# Altium project RTL_SDR_RPi_NanoPiAir_shield_V_1.PrjPcb
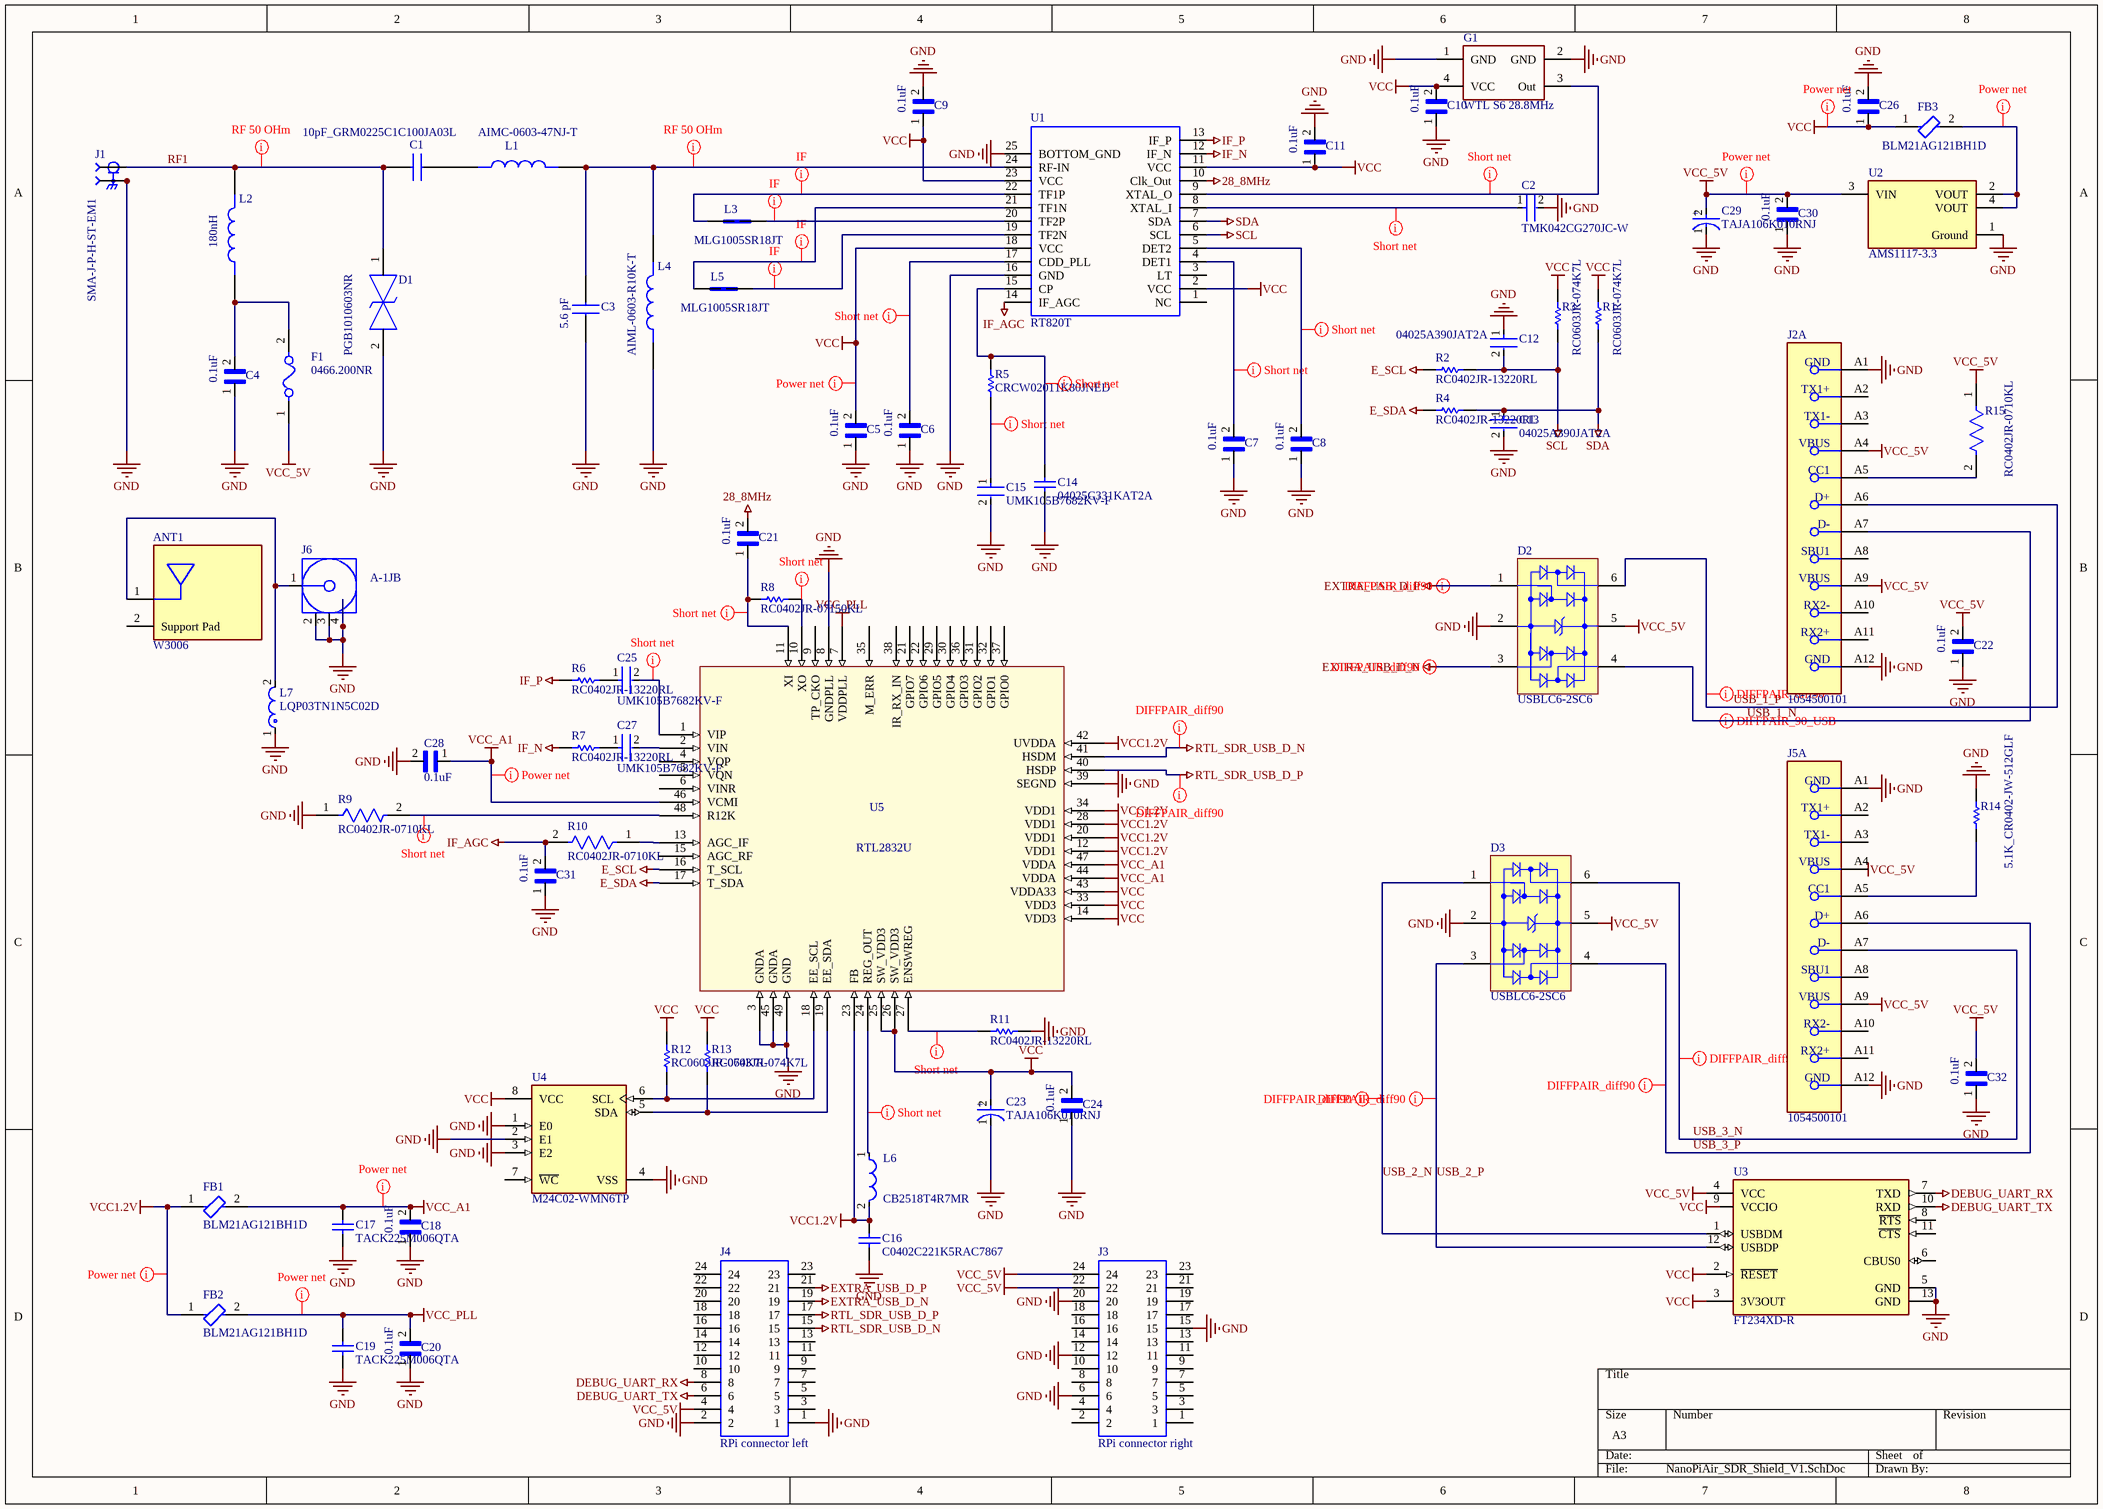
[diagram p0: NanoPiAir_SDR_Shield_V1.SchDoc]
1 sheet, 74 parts. Net scope: global (net labels, ports and power ports of the same name join across sheets).
Board file: NanoPiAir_Shield_V1.PcbDoc

## Sheet NanoPiAir_SDR_Shield_V1.SchDoc
size A3; SheetNumber: 1; SheetTotal: 1; SPICEModelCacheYCATXEQH: <root> / <DocumentId>YCATXEQH</DocumentId> / </root>

### Parts
ANT1  W3006  [FP-W3006-0]
C1  10pF_GRM0225C1C100JA03L  [CAPC0402X22N]
C2  TMK042CG270JC-W  [FP-01005-L_0_4_0_02-W_0_2-MFG]
C3  5.6 pF  [C0603]
C4  0.1uF  [CAPC1005X55N]
C5  0.1uF  [CAPC1005X55N]
C6  0.1uF  [CAPC1005X55N]
C7  0.1uF  [CAPC1005X55N]
C8  0.1uF  [CAPC1005X55N]
C9  0.1uF  [CAPC1005X55N]
C10  0.1uF  [CAPC1005X55N]
C11  0.1uF  [CAPC1005X55N]
C12  04025A390JAT2A  [FP-0402-L_1_0_1-W_0_5_0_1-IPC_B]
C13  04025A390JAT2A  [FP-0402-L_1_0_1-W_0_5_0_1-IPC_B]
C14  04025C331KAT2A  [CAPC1005X56X25NL10T15]
C15  UMK105B7682KV-F  [FP-0402-L_1_0_0_05-W_0_5-IPC_C]
C16  C0402C221K5RAC7867  [CAPC1005X60X30NL05T10]
C17  TACK225M006QTA  [CAPC1005X70X10NL20T00]
C18  0.1uF  [CAPC1005X55N]
C19  TACK225M006QTA  [CAPC1005X70X10NL20T00]
C20  0.1uF  [CAPC1005X55N]
C21  0.1uF  [CAPC1005X55N]
C22  0.1uF  [CAPC1005X55N]
C23  TAJA106K010RNJ  [FP-TAJA-MFG]
C24  0.1uF  [CAPC1005X55N]
C25  UMK105B7682KV-F  [FP-0402-L_1_0_0_05-W_0_5-IPC_C]
C26  0.1uF  [CAPC1005X55N]
C27  UMK105B7682KV-F  [FP-0402-L_1_0_0_05-W_0_5-IPC_C]
C28  0.1uF  [CAPC1005X55N]
C29  TAJA106K010RNJ  [FP-TAJA-MFG]
C30  0.1uF  [CAPC1005X55N]
C31  0.1uF  [CAPC1005X55N]
C32  0.1uF  [CAPC1005X55N]
D1  PGB1010603NR  [PGB1010603MR]
D2  USBLC6-2SC6  [STM-SOT23-6L_V]
D3  USBLC6-2SC6  [STM-SOT23-6L_V]
F1  0466.200NR  [FP-0466-MFG]
FB1  BLM21AG121BH1D  [FP-BLM21-0_2-t0_85-e0_5-IPC_B]
FB2  BLM21AG121BH1D  [FP-BLM21-0_2-t0_85-e0_5-IPC_B]
FB3  BLM21AG121BH1D  [FP-BLM21-0_2-t0_85-e0_5-IPC_B]
G1  WTL S6 28.8MHz  [XTAL_RTL_SDR(CHINA_WTL_S6)]
J1  SMA-J-P-H-ST-EM1  [SAMTEC_SMA-J-P-H-ST-EM1]
J2  1054500101  [FP-1054500101-MFG]  (part A of 3)
J3  RPi connector right  [RHDR24W77P254X254_2X12_3048X503X673P]
J4  RPi connector left  [RHDR24W77P254X254_2X12_3048X503X673P]
J5  1054500101  [FP-1054500101-MFG]  (part A of 3)
J6  A-1JB  [AMPH-A-1JB_V]
L1  AIMC-0603-47NJ-T  [INDC1608X95N]
L2  180nH  [INDC1608X95N]
L3  MLG1005SR18JT  [CAPC1005X55N]
L4  AIML-0603-R10K-T  [INDC1608X95N]
L5  MLG1005SR18JT  [CAPC1005X55N]
L6  CB2518T4R7MR  [FP-CB2518-IPC_B]
L7  LQP03TN1N5C02D  [FP-LQP03TG_02-IPC_A]
R1  RC0603JR-074K7L  [RESC1608X55X25ML10T15]
R2  RC0402JR-13220RL  [RESC1005X40X25ML05T10]
R3  RC0603JR-074K7L  [RESC1608X55X25ML10T15]
R4  RC0402JR-13220RL  [RESC1005X40X25ML05T10]
R5  CRCW02011K80JNED  [RESC0603X28X15LL05T05]
R6  RC0402JR-13220RL  [RESC1005X40X25ML05T10]
R7  RC0402JR-13220RL  [RESC1005X40X25ML05T10]
R8  RC0402JR-07150KL  [RESC1005X40X25ML05T10]
R9  RC0402JR-0710KL  [FP-RC0402-0_4-IPC_C]
R10  RC0402JR-0710KL  [FP-RC0402-0_4-IPC_C]
R11  RC0402JR-13220RL  [RESC1005X40X25ML05T10]
R12  RC0603JR-074K7L  [RESC1608X55X25ML10T15]
R13  RC0603JR-074K7L  [RESC1608X55X25ML10T15]
R14  5.1K_CR0402-JW-512GLF  [RESC1005X40X25LL10T10]
R15  RC0402JR-0710KL  [FP-RC0402-0_4-IPC_C]
U1  RT820T  [EFM8LB12F64ES0BQFN24]
U2  AMS1117-3.3  [FP-AMS1117-IPC_C]
U3  FT234XD-R  [FP-DFN-12-IPC_B]
U4  M24C02-WMN6TP  [FP-SO8N-SO-A-MFG]
U5  RTL2832U  [QFN40P600X600X84_HS-49N]

### Nets
28_8MHz: C21.2 U1.10(Clk_Out)
DEBUG_UART_RX: J4.8 U3.7(TXD)
DEBUG_UART_TX: J4.6 U3.10(RXD)
E_SCL: R2.1 U5.16(T_SCL)
E_SDA: R4.1 U5.17(T_SDA)
EXTRA_USB_D_N: D2.3(I/O_2) J4.19
EXTRA_USB_D_P: D2.1(I/O_1) J4.21
GND: C2.2 C3.1 C4.1 C5.1 C6.1 C7.1 C8.1 C9.2 C10.1 C11.2 C12.1 C13.2 C14.1 C15.2 C16.1 C17.1 C18.1 C19.1 C20.1 C22.1 C23.1(C) C24.1 C26.2 C28.2 C29.1(C) C30.1 C31.1 C32.1 D1.2 D2.2(GND) D3.2(GND) G1.1(GND) G1.2(GND) J1.2_1 J1.2_2 J1.3_1 J1.3_2 J2.A1(GND) J2.A12(GND) J3.6 J3.12 J3.15 J3.20 J4.1 J4.2 J5.A1(GND) J5.A12(GND) J6.2 J6.3 J6.4 L4.1 L7.1 R9.1 R11.2 R14.2 U1.16(GND) U1.25(BOTTOM_GND) U2.1(Ground) U3.5(GND) U3.13(GND) U4.1(E0) U4.2(E1) U4.3(E2) U4.4(VSS) U5.3(GNDA) U5.8(GNDPLL) U5.39(SEGND) U5.45(GNDA) U5.49(GND)
IF_AGC: C31.2 R10.2 U1.14(IF_AGC)
IF_N: R7.1 U1.12(IF_N)
IF_P: R6.1 U1.13(IF_P)
RTL_SDR_USB_D_N: J4.15 U5.41(HSDM)
RTL_SDR_USB_D_P: J4.17 U5.40(HSDP)
SCL: C12.2 R2.2 R3.2 U1.6(SCL)
SDA: C13.1 R1.2 R4.2 U1.7(SDA)
VCC: C5.2 C9.1 C10.2 C11.1 C23.2(A) C24.2 C26.1 FB3.1 G1.4(VCC) R1.1 R3.1 R12.1 R13.1 U1.2(VCC) U1.11(VCC) U1.18(VCC) U1.23(VCC) U3.2(~{RESET}) U3.3(3V3OUT) U4.8(VCC) U5.14(VDD3) U5.25(SW_VDD3) U5.26(SW_VDD3) U5.33(VDD3) U5.43(VDDA33)
VCC1.2V: C16.2 FB1.1 FB2.1 L6.2 U5.12(VDD1) U5.20(VDD1) U5.23(FB) U5.28(VDD1) U5.34(VDD1) U5.42(UVDDA)
VCC_5V: C22.2 C29.2(A) C30.2 C32.2 D2.5(VBUS) D3.5(VBUS) F1.1 J2.A4(VBUS) J2.A9(VBUS) J3.22 J3.24 J4.4 J5.A9(VBUS) R15.1 U2.3(VIN) U3.4(VCC)
VCC_A1: C17.2 C18.2 C28.1 FB1.2 U5.44(VDDA) U5.46(VCMI) U5.47(VDDA)
VCC_PLL: C19.2 C20.2 FB2.2 U5.7(VDDPLL)
RF1: C1.1 D1.1 J1.1 L2.2
USB_1_N: D2.4(I/O_3) J2.A7(D-)
USB_1_P: D2.6(I/O_4) J2.A6(D+)
USB_2_N: D3.1(I/O_1) U3.1(USBDM)
USB_2_P: D3.3(I/O_2) U3.12(USBDP)
USB_3_N: D3.6(I/O_4) J5.A7(D-)
USB_3_P: D3.4(I/O_3) J5.A6(D+)
NetANT1_1: ANT1.1(Feed) J6.1 L7.2
NetC1_2: C1.2 L1.1
NetC2_1: C2.1 U1.8(XTAL_I)
NetC3_2: C3.2 L1.2 L4.2 U1.24(RF-IN)
NetC4_2: C4.2 F1.2 L2.1
NetC6_2: C6.2 U1.17(CDD_PLL)
NetC7_2: C7.2 U1.4(DET1)
NetC8_2: C8.2 U1.5(DET2)
NetC14_2: C14.2 R5.2 U1.15(CP)
NetC15_1: C15.1 R5.1
NetC21_1: C21.1 R8.2 U5.11(XI)
NetC25_1: C25.1 R6.2
NetC25_2: C25.2 U5.1(VIP)
NetC27_1: C27.1 R7.2
NetC27_2: C27.2 U5.2(VIN)
NetFB3_2: FB3.2 U2.2(VOUT) U2.4(VOUT)
NetG1_3: G1.3(Out) U1.9(XTAL_O)
NetJ2_A5: J2.A5(CC1) R15.2
NetJ5_A5: J5.A5(CC1) R14.1
NetL3_1: L3.1 U1.22(TF1P)
NetL3_2: L3.2 U1.20(TF2P)
NetL5_1: L5.1 U1.21(TF1N)
NetL5_2: L5.2 U1.19(TF2N)
NetL6_1: L6.1 U5.24(REG_OUT)
NetR8_1: R8.1 U5.10(XO)
NetR9_2: R9.2 U5.48(R12K)
NetR10_1: R10.1 U5.13(AGC_IF)
NetR11_1: R11.1 U5.27(ENSWREG)
NetR12_2: R12.2 U4.6(SCL) U5.18(EE_SCL)
NetR13_2: R13.2 U4.5(SDA) U5.19(EE_SDA)

Not connected (* = marked no-connect by the designer): ANT1 2(Support_Pad); J2 A2(TX1+) A3(TX1-) A8(SBU1) A10(RX2-) A11(RX2+); J3 1 2 3 4 5 7 8 9 10 11 13 14 16 17 18 19 21 23; J4 3 5 7 9 10 11 12 13 14 16 18 20 22 23 24; J5 A2(TX1+) A3(TX1-) A4(VBUS) A8(SBU1) A10(RX2-) A11(RX2+); U1 1(NC) 3(LT); U3 6(CBUS0) 8(~{RTS}) 9(VCCIO) 11(~{CTS}); U4 7(~{WC}); U5 4(VQP) 5(VQN) 6(VINR) 9(TP_CKO) 15(AGC_RF) 21(GPIO7) 22(GPIO6) 29(GPIO5) 30(GPIO4) 31(GPIO2) 32(GPIO1) 35(M_ERR) 36(GPIO3) 37(GPIO0) 38(IR_RX_IN)

### Layout directives
net class RF_50: NetC3_2, RF1
net class IF_COILS: NetL3_1, NetL3_2, NetL5_1, NetL5_2
net class Power: NetFB3_2, VCC, VCC1.2V, VCC_5V, VCC_A1, VCC_PLL
net class SHORT_NET: NetC2_1, NetC6_2, NetC7_2, NetC8_2, NetC14_2, NetC15_1, NetC21_1, NetC25_2, NetG1_3, NetL6_1, NetR8_1, NetR9_2, NetR11_1
differential pair; differential pair class diff90: EXTRA_USB_D_N, EXTRA_USB_D_P, RTL_SDR_USB_D_N, RTL_SDR_USB_D_P, USB_1_N, USB_1_P, USB_2_N, USB_2_P, USB_3_N, USB_3_P

### Notes on the sheet
- Labels drawn without touching a wire or pin: VCC, VCC_5V
- (in symbol CMP-2000-07217-2) +

### Library data of the parts
ANT1 = CMP-16379-000003-1: RF ANT 2.4GHZ/5.5GHZ CHIP SLD; Frequency: 5GHz; Max Frequency: 5.85GHz; Min Frequency: 2.4GHz; Return Loss: -10dB; Number of Bands: 2; Impedance: 50R; Radiation Hardening: No; Mount: Surface Mount; Contact Plating: Tin; Width: 3.2mm; Series: -; Packaging: Bulk; RoHS Compliant: Yes; Package Quantity: 1; Min Operating Temperature: -40°C; Number of Pins: 2; Length: 10mm; Termination: Solder; Height: 0.059inch; Max Operating Temperature: 85°C; Case/Package: SMD/SMT
C1 = GRM0225C1C100JA03L: Cap Ceramic 10pF 16V C0G 5% Pad SMD 01005 125C T/R; Manufacturer_Name: Murata Electronics; Geometry.Height: 0.22mm; Mouser Part Number: 81-GRM0225C1C100JA3L; Mouser Price/Stock: https://www.mouser.co.uk/ProductDetail/Murata-Electronics/GRM0225C1C100JA03L?qs=qkDYIeTQ%252BEn9GodD6pJsiA%3D%3D; Manufacturer_Part_Number: GRM0225C1C100JA03L; Datasheet Link: https://datasheet.datasheetarchive.com/originals/distributors/DKDS-10/189393.pdf
C2 = CMP-14477-000467-2: None; RoHS Compliant: Yes
C3 = C0603C569C5GACTU: SMD Comm C0G, Ceramic, 5.6 pF, +/-0.25 pF, 50 VDC, 125 VDC, 125C, -55C, C0G, SMD, MLCC, Ultra-Stable, Low Loss, Class I, 0.1 % , 100 GOhms, 3.7 mg, 0603, 1.6mm, 0.8mm, 0.8mm, 0.7mm, 0.35mm, 4000, 78  Weeks, 120; Manufacturer_Name: KEMET; Geometry.Height: 0.87mm; Mouser Part Number: 80-C0603C569C5G; Mouser Price/Stock: https://www.mouser.co.uk/ProductDetail/KEMET/C0603C569C5GACTU?qs=5GGmbjqkbYeYpfQi22ubQQ%3D%3D; Manufacturer_Part_Number: C0603C569C5GACTU; Datasheet Link: https://content.kemet.com/datasheets/KEM_C1003_C0G_SMD.pdf
C4-C11 C18 C20-C22 C24 C26 C28 C30-C32 = LMF105B7104KVHF: Package: None; Price: None; Value: *; MP: LMF105B7104KVHF; Availability: Unavailable
C12 C13 = CMP-1034-01046-3: General Purpose Ceramic Capacitor, 0402, 39pF, 5%, C0G, 30ppm/°C, 50V; Package Quantity: 10000; Length: 1mm; Case/Package: 0402; Mount: Surface Mount; Temperature Coefficient: 0ppm/°C; Tolerance: 5%; Max Operating Temperature: 125°C; Thickness: 0.022inch; Voltage Rating: 50V; Depth: 0.5mm; Voltage Rating (DC): 50V; Contact Plating: Tin; Case Code (Imperial): 0402; Dielectric Material: Ceramic; RoHS Compliant: Yes; Packaging: Tape and Reel; Number of Pins: 2; Lead Free: Lead Free; Width: 0.02inch; Height: 0.5mm; Radiation Hardening: No; Dielectric: C0G; REACH SVHC: No SVHC; Case Code (Metric): 1005; Voltage: 50V; Construction: Flat; Min Operating Temperature: -55°C; Capacitance: 39pF; Termination: SMD/SMT; Series: 0402
C14 = CMP-2008-02720-1: Manufacturer: AVX Interconnect / Elco; Part Number: 04025C331KAT2A
C15 C25 C27 = CMP-14477-001974-2: None; Voltage Rating: 50V; Dielectric: X7R; Tolerance: 10%; Capacitance: 6.8nF; Series: M; Termination: SMD/SMT; Halogen Free: Halogen Free; Radiation Hardening: No; Package Quantity: 10000; Thickness: 0.022inch; Case/Package: 0402; Case Code (Metric): 1005; Max Operating Temperature: 125°C; Depth: 0.5mm; Case Code (Imperial): 0402; Construction: Flat; Length: 1mm; Lead Free: Lead Free; Voltage Rating (DC): 50V; RoHS Compliant: Yes; Mount: Surface Mount; Width: 0.02inch; Height: 0.5mm; Voltage: 50V; Packaging: Tape and Reel; Min Operating Temperature: -55°C
C16 = CMP-2008-03137-2: Manufacturer: Kemet; Part Number: C0402C221K5RAC7867
C17 C19 = CMP-2008-00070-1: Manufacturer: AVX Interconnect / Elco; Part Number: TACK225M006QTA
C23 C29 = CMP-2000-07217-2: 10uF 10V  ±10% 3Ω 1206  SMD Tantalum Capacitor; ESR (Equivalent Series Resistance): 3R; Dissipation Factor: 6%; Leakage Current: 1uA; Polarity: Polar; Q Factor: 6; Case Code (Imperial): 1206; RoHS Compliant: Yes; Case Code (Metric): 3216; Voltage Rating (DC): 10V; REACH SVHC: No SVHC; Mount: Surface Mount; Package Quantity: 1; Radiation Hardening: No; Width: 1.6mm; Depth: 1.6mm; Packaging: Tape and Reel; Termination: SMD/SMT; Length: 3.2mm; Tolerance: 10%; Features: General Purpose; Capacitance: 10uF; Case/Package: 1206; Max Operating Temperature: 125°C; Voltage Rating: 10V; Height - Seated (Max): 0.071inch; Series: TAJ; Height: 1.6mm; Min Operating Temperature: -55°C; Voltage: 10V; Number of Pins: 2; Construction: Flat; Dielectric Material: Tantalum; Lead Free: Lead Free
D1 = PGB1010603NR: ESD Suppressors / TVS Diodes 0603 24VDC .06pF; Manufacturer_Name: LITTELFUSE; Geometry.Height: 0.36mm; Mouser Part Number: 576-PGB1010603NR; Mouser Price/Stock: https://www.mouser.co.uk/ProductDetail/Littelfuse/PGB1010603NR?qs=gu7KAQ731UTJOoBJUwB8FA%3D%3D; Manufacturer_Part_Number: PGB1010603NR; Datasheet Link: https://www.littelfuse.com/data/en/data_sheets/littelfuse_pulseguard-esd_pgb1.pdf
D2 D3 = CMP-2000-05378-1: Very low capacitance ESD protection, 3.5 pF, -40 to 125 degC, 6-Pin SOT23, RoHS, Tape and Reel; Manufacturer: STMicroelectronics; Polarity: Uni-Directional; Clamping Voltage: 17V; Rad Hardened: No; Product Height (mm): 1.3mm; Leakage Current (Max): 0.15uA; Product Length (mm): 3.05mm; Number of Elements: 1; Peak Pulse Current: 5A; Configuration: Dual; Reverse Breakdown Voltage: 6V; Working Voltage (Max): 5V; Capacitance Value: 3.5pF; Suppressor Type: DiodeArrays; Product Depth (mm): 1.75mm; Test Current (It): 1mA; Package / Case: SOT-23; Operating Temperature Max Deg. C: 125C; Package Description: 6-Pin Small Outline Transistor, Body 2.925 x 1.625 mm, Pitch 0.95 mm; Package Reference: SOT23-6L; Datasheet Version: Rev. 5, 10/2011; Operating Temperature Min Deg. C: -40C; Mounting Style: SurfaceMount; Direction Type: Uni-Directional; Mounting: SurfaceMount; Pin Count: 6; Leakage Current: 0.15uA; Packaging: TapeandReel; Operating Temperature Classification: Automotive; Clamping Voltage (Max): 17V; Manufacturer URL: http://www.st.com/; Reverse Stand-off Voltage: 5V; Datasheet URL: http://www.st.com/st-web-ui/static/active/en/resource/technical/document/datasheet/CD00050750.pdf; Working Voltage: 5V; Operating Temp Range: -40Cto125C
F1 = CMP-08605-000081-1: FUSE BOARD MNT 200MA 125VAC/VDC; Body Material: Thermoplastic; Voltage Rating: 125V; Fuse Type: Board Mount (Cartridge Style Excluded); Resistance: 1.15R; Approvals: UL; DC Cold Resistance: 1.16R; Case Code (Metric): 3216; Depth: 1.52mm; Case/Package: 1206; Lead Free: Lead Free; Length: 3.18mm; Max Operating Temperature: 90°C; Case Code (Imperial): 1206; Terminal Material: Copper; Radiation Hardening: No; Working Voltage: 125V; Packaging: Tape and Reel; Width: 0.06inch; Housing Material: Ceramic; Voltage Rating (AC): 125V; Current Rating: 200mA; Fuse Current: 200mA; Package Quantity: 5000; Height: 0.023inch; Termination: SMD/SMT; Voltage Rating (DC): 125V; Mount: Surface Mount; Min Operating Temperature: -55°C; Number of Pins: 2
FB1-FB3 = CMP-06046-002535-1: Chip Ferrite Bead, 0805, 120Ω @ 100MHz, 0.09Ω, 25%, 1A; RoHS Compliant: Yes
G1 = WTL S6 28.8MHz: 28.2 MHz Â±1ppm Generator; MF: ECS Inc.; MP: ECS-160-18-7SX-TR; SnapEDA_Link: https://www.snapeda.com/parts/ECS-160-18-7SX-TR/ECS+Inc./view-part/?ref=snap; Value: *; Purchase-URL: https://pricing.snapeda.com/search/part/ECS-160-18-7SX-TR/?ref=eda; Digi-Key_Part_Number: XC2021-2-ND; Check_prices: https://www.snapeda.com/parts/ECS-160-18-7SX-TR/ECS+Inc./view-part/?ref=eda; Package: SOJ-4 ECS International; ComponentLink1Description: New link; ComponentLink1URL: https://aliexpress.ru/item/1005003294067027.html?sku_id=12000025061369255&spm=a2g2w.productlist.search_results.25.2fdd4aa6qno35b
J1 = SMA-J-P-H-ST-EM1: SMA Connector Jack, Female Socket 50Ohm Board Edge, End Launch Solder; Price: None; MP: SMA-J-P-H-ST-EM1; Value: *; Availability: Unavailable; Package: None
J2 J5 = CMP-04767-000004-1: CONN RCP USB3.1 TYPEC 24P SMD RA; Manufacturer: Molex; Number Of Contacts: 24; Voltage Rating: 30V; Shielding: true; Is Female: yes; Current Rating: 0.25/1.25/5A; Pitch: 0.5mm; Conn Orientation: Right Angle; Package: 0; Height: 3.44mm; Footprint Url: https://www.molex.com/pdm_docs/sd/1054500101_sd.pdf; Device Class L1: Connectors; Category: Conn; Device Class L2: USB Connectors; Digikey Description: CONN RCP USB3.1 TYPEC 24P SMD RA; Contact Material: Gold,Nickel; Mouser Description: USB Shielded I/O Receptacle; Type C; Right Angle; Surface Mount; Gold over Nickel; ComponentLink2Description: Datasheet; Lead Free: Yes; Automotive: No; Temperature Range High: +85°C; RoHS: TRUE; Octopart: https://octopart.com/105450-0101-molex-68082325; ComponentLink2URL: https://www.molex.com/webdocs/datasheets/pdf/en-us/1054500101_IO_CONNECTORS.pdf; Temperature: -30°C to +85°C; Usb Standard: USB 3.1; Temperature Range Low: -30°C; Device Class L3: unset; Manufacturer Part Number: 1054500101
J3 J4 = 6-534998-2: Headers & Wire Housings RECEPT 24POS .100 VERT DUAL; Manufacturer_Name: TE Connectivity; Geometry.Height: 6.73mm; Mouser Part Number: 571-6-534998-2; Mouser Price/Stock: https://www.mouser.co.uk/ProductDetail/TE-Connectivity-AMP/6-534998-2?qs=xDp7PGUNC%252BvdpX02YDLw2A%3D%3D; Manufacturer_Part_Number: 6-534998-2; Datasheet Link: https://www.te.com/commerce/DocumentDelivery/DDEController?Action=showdoc&DocId=Customer+Drawing%7F534998%7FP7%7Fpdf%7FEnglish%7FENG_CD_534998_P7.pdf%7F6-534998-2
J6 = CMP-1743-00001-1: AMC PCB Jack, 0 to 60 GHz, 60 V, -40 to 90 degC, 4-Pin SMD, RoHS, Tape and Reel; Capacitance: 100 uF; Case\Package: 2917; Voltage Rating (DC): 10 V; ESR: 700 mohm; Tolerance: 10%; ComponentLink1Description: Datasheet; PackageDescription: 4-Pin Surface Mount Device, Body 2.6 x 2.6 mm; Radiation Hardening: No; Package Quantity: 1; REACH SVHC: No SVHC; DatasheetVersion: Rev. K, 05/2016; ComponentLink1URL: http://drawings.amphenolrf.com/Customer_Outline/CA-1JB.pdf; Pins: 2; Packaging: Tape and Reel; Min Operating Temperature: -55 degC; RoHSCompliant: true; Length: 7.3 mm; PackageReference: A-1JB; Weight: 0.023634 oz; Mount: Surface Mount; Voltage Rating: 10 V; Max Operating Temperature: 125 degC; Height: 3.1 mm; Case Code (Imperial): 2917; Case Code (Metric): 7343; Width: 4.3 mm
L1 = AIMC-0603-47NJ-T: IND 47nH 0.3A 700mâ„¦; MF: Abracon; SnapEDA_Link: https://www.snapeda.com/parts/AIMC-0603-47NJ-T/Abracon/view-part/?ref=snap; Package: 0603 Abracon; Purchase-URL: https://pricing.snapeda.com/search/part/AIMC-0603-47NJ-T/?ref=eda; Price: None; Value: *; MP: AIMC-0603-47NJ-T; Availability: In Stock; Check_prices: https://www.snapeda.com/parts/AIMC-0603-47NJ-T/Abracon/view-part/?ref=eda
L2 = AIML-0603-R18K-T: IND 0.18uH 0.05A 600mâ„¦; MF: Abracon; MP: AIML-0603-R18K-T; SnapEDA_Link: https://www.snapeda.com/parts/AIML-0603-R18K-T/Abracon/view-part/?ref=snap; Purchase-URL: https://pricing.snapeda.com/search/part/AIML-0603-R18K-T/?ref=eda; Package: 1608 Taiyo Yuden; Digi-Key_Part_Number: 535-11612-2-ND; Check_prices: https://www.snapeda.com/parts/AIML-0603-R18K-T/Abracon/view-part/?ref=eda; Value: *
L3 L5 = MLG1005SR18JT: Ind High Frequency Chip Unshielded Multi-Layer 180nH 5% 100MHz 8Q-Factor Ceramic 150mA 0402 T/R; Package: None; Price: None; Value: *; MP: MLG1005SR18JT; Availability: Unavailable
L4 = AIML-0603-R10K-T: 100 nH Shielded Multilayer Inductor 50 mA 500mOhm Max 0603 (1608 Metric); MF: Abracon; SnapEDA_Link: https://www.snapeda.com/parts/AIML-0603-R10K-T/Abracon/view-part/?ref=snap; Check_prices: https://www.snapeda.com/parts/AIML-0603-R10K-T/Abracon/view-part/?ref=eda; Availability: In Stock; MP: AIML-0603-R10K-T; Package: 1608 Taiyo Yuden; Purchase-URL: https://pricing.snapeda.com/search/part/AIML-0603-R10K-T/?ref=eda; Value: *; Price: None
L6 = CMP-14484-000470-1: SMD Inductors 4.7uH ±20% 1.2A 0.13Ω 1007; Shielding: Unshielded; Self Resonant Frequency: 46MHz; Saturation Current: 310mA; Core Material: Ferrite; DC Resistance (DCR): 130mR; Test Frequency: 7.96MHz; Inductance Tolerance: 20%; Min Operating Temperature: -40°C; Series: CB; Depth: 2mm; Height - Seated (Max): 0.079inch; Radiation Hardening: No; Current Rating: 1.2A; Halogen Free: Halogen Free; Height: 1.8mm; RoHS Compliant: Yes; Inductance: 4.7uH; Length: 0.098inch; Packaging: Tape and Reel; Package Quantity: 2000; Termination: SMD/SMT; Resistor Type: Wirewound; Case Code (Metric): 2518; Tolerance: 20%; Case Code (Imperial): 1007; Case/Package: 1007; Max DC Current: 1.2A; Width: 0.071inch; Max Operating Temperature: 105°C; Lead Free: Lead Free; Mount: Surface Mount
L7 = CMP-06042-004740-1: Film type RF Inductor 1.5nH ±0.2nH 600mA 0.15Ω 0201 (0603); DC Resistance (DCR): 150mR; Test Frequency: 500MHz; Shielding: Unshielded; Core Material: Non-Magnetic; Q Factor: 14; Self Resonant Frequency: 15GHz; Current Rating: 600mA; Packaging: Tape and Reel; Weight: 6E-06oz; Termination: SMD/SMT; Case Code (Imperial): 0201; Max DC Current: 600mA; Case Code (Metric): 0603; Case/Package: 0201; Width: 0.012inch; Radiation Hardening: No; DC Current: 600mA; Package Quantity: 15000; Length: 0.024inch; Depth: 0.33mm; Max Operating Temperature: 125°C; Min Operating Temperature: -55°C; Inductance: 1.5nH; Height: 0.3mm; Height - Seated (Max): 0.013inch; Lead Free: Lead Free; Military Standard: Not; Resistor Type: Thin Film; Mount: Surface Mount
R1 R3 R12 R13 = CMP-2000-05024-1: Chip Resistor, 4.7 KOhm, +/- 5%, 100 mW, -55 to 155 degC, 0603 (1608 Metric), RoHS, Tape and Reel; Manufacturer: Yageo; Resistance: 4.7kOhms; Temperature Coefficient: 100PPM/C; Power Rating: 100mW; Voltage Rating: 50V; Operating Temperature Range: -55Cto+155C; Case Code - mm: 1608; Tolerance: 5%; Product: ThickFilmResistorsGeneralPurpose; Case Code - in: 0603; Datasheet URL: http://www.yageo.com/documents/recent/PYu-RC_Group_51_RoHS_L_04.pdf; Package Reference: 603; Datasheet Version: Rev. 4, 02/2016; Package Description: 2-Pin Surface Mount Device, Body 1.6 x 0.8 mm; Manufacturer URL: http://www.yageo.com/; Series: RC; Packaging: Reel; Termination Style: SMD/SMT
R2 R4 R6 R7 R11 = CMP-2002-08074-1: Manufacturer: Yageo; Part Number: RC0402JR-13220RL
R5 = CMP-1010-00080-2: Manufacturer: Vishay Dale; Part Number: CRCW02011K80JNED
R8 = CMP-1011-00126-2: Manufacturer: Yageo / Phycomp; Part Number: RC0402JR-07150KL
R9 R10 R15 = CMP-2002-07915-3: RES 10K OHM 5% 1/16W 0402; Max Power Dissipation: 63mW; Temperature Coefficient: 100ppm/°C; Power Rating: 62.5mW; Resistance: 10kR; Voltage Rating: 50V; Size Code: 0402; Resistance Tolerance: 5%; Packaging: Tape and Reel; Case Code (Metric): 1005; Lead Free: Lead Free; Resistor Type: Thick Film; Min Operating Temperature: -55°C; Military Standard: Not; Depth: 0.5mm; Series: RC; Case/Package: 0402; Construction: Rectangular; Number of Terminations: 2; Package Quantity: 1; Termination: SMD/SMT; Length: 0.039inch; Case Code (Imperial): 0402; Height: 0.016inch; Features: Moisture Resistant; RoHS Compliant: Yes; Max Operating Temperature: 155°C; Tolerance: 5%; Width: 0.02inch
R14 = CMP-1011-00091-2: Manufacturer: Bourns; Part Number: CR0402-JW-512GLF
U1 = RT820T-QFN24: High Performance Low Power / Advanced Digital TV Silicon Tuner; Manufacturer_Name: Rafael Technology; Geometry.Height: 0.9mm; Manufacturer_Part_Number: RT820T; Datasheet Link: https://www.rtl-sdr.com/wp-content/uploads/2013/04/R820T_datasheet-Non_R-20111130_unlocked1.pdf
U2 = CMP-209535-000001-1: LDO Voltage Regulators 1A, 3.3V; Manufacturer: Advanced Monolithic Systems; Dropout Voltage: 1.1V; Output Type: Fixed; Nominal Supply Current: 5mA; Max Power Dissipation: 1.2W; Max Supply Voltage: 15V; Number Of Outputs: 1; Standoff Height: 0.64mm; Max Junction Temp: +125°C; Height: 1.8mm; Package: AMS1117; Device Class L2: Power Management ICs; ComponentLink2Description: Datasheet; ComponentLink2URL: http://www.advanced-monolithic.com/pdf/ds1117.pdf; Category: IC; RoHS: TRUE; Automotive: No; Device Class L1: Integrated Circuits (ICs); Output Current: 1A; Device Class L3: Voltage Regulators - Linear; Temperature: -40°C to +125°C; Output Voltage: 3.3V; Manufacturer Part Number: AMS1117-3.3; Temperature Range Low: -40°C; Octopart: https://octopart.com/ams1117-3.3-advanced+monolithic+systems-25899300; Lead Free: Yes; Ipc Land Pattern Name: SOT229P700X180-4; Temperature Range High: +125°C
U3 = CMP-0248-00027-3: IC USB SERIAL BASIC UART 12DFN; Min Supply Voltage: 2.97V; Number of Ports: 1; Operating Supply Voltage: 5V; Operating Supply Current: 8mA; Max Supply Voltage: 5.5V; Data Rate: 3Mbps; Length: 3mm; Case/Package: DFN; Mount: Surface Mount; Packaging: Tape and Reel; Max Operating Temperature: 85°C; Height: 0.75mm; Number of Pins: 12; Number of Transceivers: 1; Package Quantity: 5000; Min Operating Temperature: -40°C; Width: 3mm; REACH SVHC: No SVHC; Interface: UART; Lead Free: Lead Free
U4 = CMP-2000-05370-2: IC EEPROM 2K I2C 400KHZ 8SO; Manufacturer: STMicroelectronics; Min Supply Voltage: 2.5V; Standoff Height: 0.1mm; Nominal Supply Current: 0.5-1mA; Access Time: 900ns; Memory Size: 2Kbits; Max Supply Voltage: 5.5V; Digikey Description: IC EEPROM 2K I2C 400KHZ 8SO; Memory Type: EEPROM; ComponentLink2URL: https://www.st.com/resource/en/datasheet/m24c02-w.pdf; Device Class L3: EEPROM; Interface: I2C; Temperature Range High: +85°C; Mouser Description: M24C02 Series 2 Kb (256 x 8) 2.5 V SMT Serial I²C Bus EEPROM - SOIC-8; RoHS: TRUE; Lead Free: Yes; Ambient Temperature Range Low: -40°C; Temperature: -40°C to +85°C; Device Class L1: Integrated Circuits (ICs); Temperature Range Low: -40°C; Frequency: 400kHz; Category: IC; Manufacturer Part Number: M24C02-WMN6TP; Height: 1.75mm; Octopart: https://octopart.com/m24c02-wmn6tp-stmicroelectronics-55404516; Automotive: No; Ambient Temperature Range High: +85°C; ComponentLink2Description: Datasheet; Package: SO8N-SO-A; Device Class L2: Memory
U5 = RTL2832U: RTL2832U DVB-T COFDM Demodulator + USB 2.0; Manufacturer: Realtek; Publisher: ftg; ComponentLink1Description: Work on RTL2832U Datasheet; ComponentLink1URL: https://sites.google.com/site/oh2ftg/home/rtl2832u; Mounting: Surface Mount; Package: QFN48